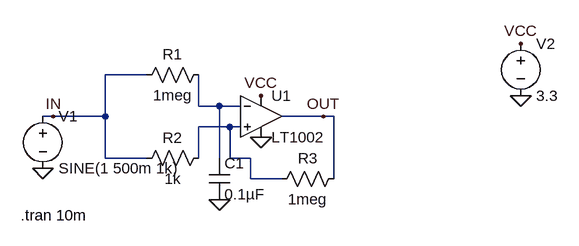
[diagram p0: schematic schmitt_bit_slice.asc]
schmitt_bit_slice.asc, the LTspice schematic file:
Version 4
SHEET 1 880 680
WIRE 112 128 48 128
WIRE 192 176 192 128
WIRE 224 176 192 176
WIRE 256 176 224 176
WIRE -32 192 -48 192
WIRE 48 192 48 128
WIRE 48 192 -32 192
WIRE 384 192 320 192
WIRE 400 192 384 192
WIRE 240 208 192 208
WIRE 256 208 240 208
WIRE 48 256 48 192
WIRE 112 256 48 256
WIRE 192 256 192 208
WIRE 224 256 224 176
WIRE 240 256 240 208
WIRE 272 256 240 256
WIRE 272 288 272 256
WIRE 320 288 272 288
WIRE 400 288 400 192
FLAG 224 320 0
FLAG 288 224 0
FLAG 288 160 VCC
FLAG -32 192 IN
FLAG 384 192 OUT
FLAG -48 272 0
FLAG 688 160 0
FLAG 688 80 VCC
SYMBOL Opamps\\LT1002 288 128 R0
SYMATTR InstName U1
SYMBOL res 208 112 R90
WINDOW 0 0 56 VBottom 2
WINDOW 3 32 56 VTop 2
SYMATTR InstName R1
SYMATTR Value 1meg
SYMBOL res 208 240 R90
WINDOW 0 0 56 VBottom 2
WINDOW 3 32 56 VTop 2
SYMATTR InstName R2
SYMATTR Value 1k
SYMBOL cap 208 256 R0
SYMATTR InstName C1
SYMATTR Value 0.1µF
SYMBOL res 416 272 R90
WINDOW 0 0 56 VBottom 2
WINDOW 3 32 56 VTop 2
SYMATTR InstName R3
SYMATTR Value 1meg
SYMBOL voltage -48 176 R0
WINDOW 123 0 0 Left 2
WINDOW 39 0 0 Left 2
SYMATTR InstName V1
SYMATTR Value SINE(1 500m 1k)
SYMBOL voltage 688 64 R0
WINDOW 123 0 0 Left 2
WINDOW 39 0 0 Left 2
SYMATTR InstName V2
SYMATTR Value 3.3
TEXT -82 344 Left 2 !.tran 10m

The netlist it stands for:
* schmitt_bit_slice.asc
XU1 N002 N001 VCC 0 OUT LT1002  ; pins In+ In- V+ V- OUT
R1 N001 IN 1meg
R2 N002 IN 1k
C1 N001 0 0.1µF
R3 OUT N002 1meg
V1 IN 0 SINE(1 500m 1k)
V2 VCC 0 3.3
.tran 10m
.backanno
.end

* Results of the author's LTspice run, read from the files saved beside the schematic
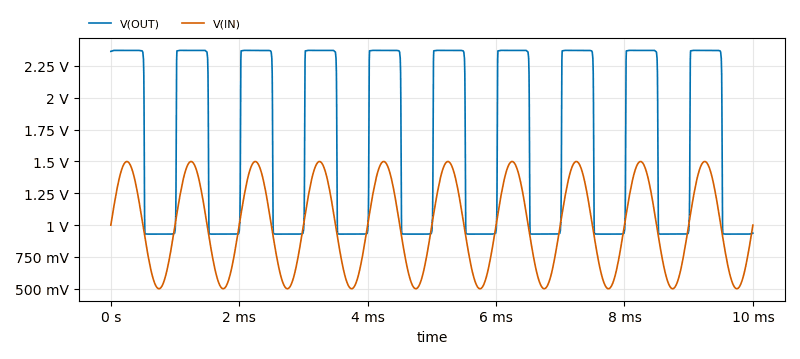
[diagram p1: Transient Analysis of schmitt_bit_slice.asc, plotted from the saved traces]
* Transient Analysis, 1 run:
*   V(OUT): min 929.6 mV, max 2.371 V, average 1.655 V, rms 1.801 V, last 936.9 mV
*   V(IN): min 500.5 mV, max 1.499 V, average 999.9 mV, rms 1.061 V, last 1 V